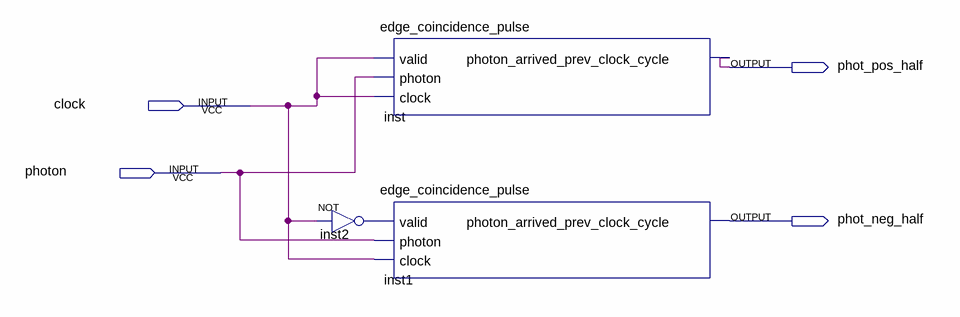
[diagram p0: schematic sheet]
// Quartus schematic pulse_sorter_basic.bdf as structural Verilog: 3 symbols, 4 pins
module pulse_sorter_basic (
  input  clock,
  input  photon,
  output phot_pos_half,
  output phot_neg_half
);

  wire inst2_out;

  edge_coincidence_pulse inst (
    .valid(clock), .photon(photon), .clock(clock), .photon_arrived_prev_clock_cycle(phot_pos_half));
  edge_coincidence_pulse inst1 (
    .valid(inst2_out), .photon(photon), .clock(clock), .photon_arrived_prev_clock_cycle(phot_neg_half));
  not inst2 (inst2_out, clock);
endmodule
